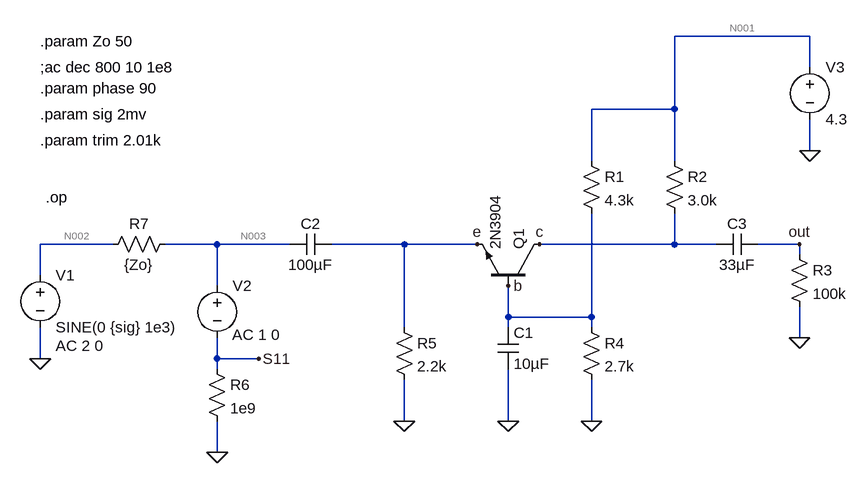
[diagram p0: schematic CB-Isolation-Amp.asc]
CB-Isolation-Amp.asc, the LTspice schematic file:
Version 4
SHEET 1 880 680
WIRE 656 -144 448 -144
WIRE 656 -96 656 -144
WIRE 448 -32 448 -144
WIRE 448 -32 320 -32
WIRE 656 32 656 -16
WIRE 320 48 320 -32
WIRE 448 48 448 -32
WIRE -416 176 -528 176
WIRE -256 176 -336 176
WIRE -144 176 -256 176
WIRE 32 176 -80 176
WIRE 144 176 32 176
WIRE 448 176 448 128
WIRE 448 176 240 176
WIRE 512 176 448 176
WIRE 640 176 576 176
WIRE 640 192 640 176
WIRE -528 224 -528 176
WIRE -256 240 -256 176
WIRE 192 288 192 240
WIRE 320 288 320 128
WIRE 320 288 192 288
WIRE 32 304 32 176
WIRE 192 304 192 288
WIRE 320 304 320 288
WIRE 640 320 640 272
WIRE -528 352 -528 304
WIRE -256 352 -256 320
WIRE -192 352 -256 352
WIRE -256 368 -256 352
WIRE 32 448 32 384
WIRE 192 448 192 368
WIRE 320 448 320 384
WIRE -256 496 -256 448
FLAG -528 352 0
FLAG -256 496 0
FLAG 32 448 0
FLAG 192 448 0
FLAG 320 448 0
FLAG 640 320 0
FLAG 656 32 0
FLAG -192 352 S11
FLAG 640 176 out
FLAG 144 176 e
FLAG 240 176 c
FLAG 192 240 b
SYMBOL npn 240 240 M270
SYMATTR InstName Q1
SYMATTR Value 2N3904
SYMBOL res 304 32 R0
SYMATTR InstName R1
SYMATTR Value 4.3k
SYMBOL res 432 32 R0
SYMATTR InstName R2
SYMATTR Value 3.0k
SYMBOL res 624 176 R0
SYMATTR InstName R3
SYMATTR Value 100k
SYMBOL res 304 288 R0
SYMATTR InstName R4
SYMATTR Value 2.7k
SYMBOL res 16 288 R0
SYMATTR InstName R5
SYMATTR Value 2.2k
SYMBOL res -272 352 R0
SYMATTR InstName R6
SYMATTR Value 1e9
SYMBOL res -320 160 R90
WINDOW 0 0 56 VBottom 2
WINDOW 3 32 56 VTop 2
SYMATTR InstName R7
SYMATTR Value {Zo}
SYMBOL voltage -528 208 R0
WINDOW 123 24 124 Left 2
WINDOW 39 0 0 Left 0
SYMATTR Value2 AC 2 0
SYMATTR InstName V1
SYMATTR Value SINE(0 {sig} 1e3)
SYMBOL voltage -256 224 R0
WINDOW 123 23 91 Left 2
WINDOW 39 0 0 Left 0
SYMATTR Value2 AC 1 0
SYMATTR InstName V2
SYMATTR Value ""
SYMBOL voltage 656 -112 R0
SYMATTR InstName V3
SYMATTR Value 4.3
SYMBOL cap 176 304 R0
SYMATTR InstName C1
SYMATTR Value 10µF
SYMBOL cap -80 160 R90
WINDOW 0 0 32 VBottom 2
WINDOW 3 32 32 VTop 2
SYMATTR InstName C2
SYMATTR Value 100µF
SYMBOL cap 576 160 R90
WINDOW 0 0 32 VBottom 2
WINDOW 3 32 32 VTop 2
SYMATTR InstName C3
SYMATTR Value 33µF
TEXT -528 -136 Left 2 !.param Zo 50
TEXT -528 -96 Left 2 !;ac dec 800 10 1e8
TEXT -528 -64 Left 2 !.param phase 90
TEXT -528 -24 Left 2 !.param sig 2mv
TEXT -528 16 Left 2 !.param trim 2.01k
TEXT -520 104 Left 2 !.op

The netlist it stands for:
* CB-Isolation-Amp.asc
Q1 c b e 0 2N3904
R1 N001 b 4.3k
R2 N001 c 3.0k
R3 out 0 100k
R4 b 0 2.7k
R5 e 0 2.2k
R6 S11 0 1e9
R7 N003 N002 {Zo}
V1 N002 0 SINE(0 {sig} 1e3) AC 2 0
V2 N003 S11 AC 1 0
V3 N001 0 4.3
C1 b 0 10µF
C2 e N003 100µF
C3 out c 33µF
.model NPN NPN
.model PNP PNP
.lib standard.bjt
.param Zo 50
;ac dec 800 10 1e8
.param phase 90
.param sig 2mv
.param trim 2.01k
.op
.backanno
.end

* Results of the author's LTspice run, read from the files saved beside the schematic
* Operating Point:
*   V(c) = 2.912 V
*   V(b) = 1.656 V
*   V(e) = 1.021 V
*   V(n001) = 4.3 V
*   V(out) = 9.61 pV
*   V(s11) = 5.105 fV
*   V(n003) = 5.105 fV
*   V(n002) = 0 V
*   Ic(Q1) = 462.6 µA
*   Ib(Q1) = 1.525 µA
*   Ie(Q1) = -464.1 µA
*   I(C3) = 0 A
*   I(C2) = 0 A
*   I(C1) = 0 A
*   I(R7) = 0 A
*   I(R6) = 0 A
*   I(R5) = 464.1 µA
*   I(R4) = 613.3 µA
*   I(R3) = 0 A
*   I(R2) = 462.6 µA
*   I(R1) = 614.9 µA
*   I(V3) = -1.077 mA
*   I(V2) = 0 A
*   I(V1) = 0 A
* From the log:
*   Semiconductor Device Operating Points:
*                           --- Bipolar Transistors ---
*   Name:       q1
*   Model:    2n3904
*   Ib:       1.52e-06
*   Ic:       4.63e-04
*   Vbe:      6.35e-01
*   Vbc:     -1.26e+00
*   Vce:      1.89e+00
*   BetaDC:   3.03e+02
*   Gm:       1.79e-02
*   Rpi:      1.70e+04
*   Rx:       2.00e+01
*   Ro:       2.19e+05
*   Cbe:      1.86e-11
*   Cbc:      2.89e-12
*   Cjs:      0.00e+00
*   BetaAC:   3.03e+02
*   Cbx:      0.00e+00
*   Ft:       1.32e+08